# EAGLE schematic post_schematic_v4_charlieplex_v30 (EAGLE 9.7.0)

## Sheet 1 of 2: post_schematic_v4_charlieplex
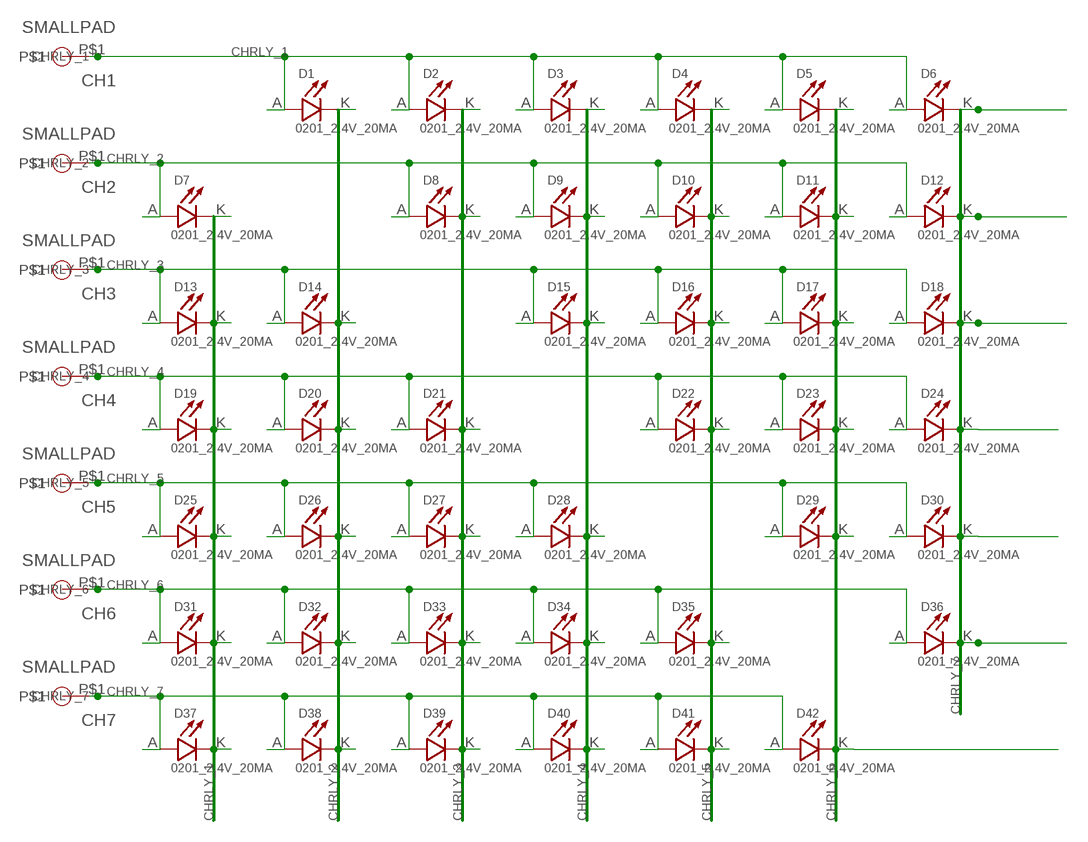
[diagram p0: schematic, sheet 1]

### Parts
CH1  SMALLPAD  [SMALLPAD]
CH2  SMALLPAD  [SMALLPAD]
CH3  SMALLPAD  [SMALLPAD]
CH4  SMALLPAD  [SMALLPAD]
CH5  SMALLPAD  [SMALLPAD]
CH6  SMALLPAD  [SMALLPAD]
CH7  SMALLPAD  [SMALLPAD]
D1  0201_2.4V_20MA  [0201_2.4V_20MA]
D2  0201_2.4V_20MA  [0201_2.4V_20MA]
D3  0201_2.4V_20MA  [0201_2.4V_20MA]
D4  0201_2.4V_20MA  [0201_2.4V_20MA]
D5  0201_2.4V_20MA  [0201_2.4V_20MA]
D6  0201_2.4V_20MA  [0201_2.4V_20MA]
D7  0201_2.4V_20MA  [0201_2.4V_20MA]
D8  0201_2.4V_20MA  [0201_2.4V_20MA]
D9  0201_2.4V_20MA  [0201_2.4V_20MA]
D10  0201_2.4V_20MA  [0201_2.4V_20MA]
D11  0201_2.4V_20MA  [0201_2.4V_20MA]
D12  0201_2.4V_20MA  [0201_2.4V_20MA]
D13  0201_2.4V_20MA  [0201_2.4V_20MA]
D14  0201_2.4V_20MA  [0201_2.4V_20MA]
D15  0201_2.4V_20MA  [0201_2.4V_20MA]
D16  0201_2.4V_20MA  [0201_2.4V_20MA]
D17  0201_2.4V_20MA  [0201_2.4V_20MA]
D18  0201_2.4V_20MA  [0201_2.4V_20MA]
D19  0201_2.4V_20MA  [0201_2.4V_20MA]
D20  0201_2.4V_20MA  [0201_2.4V_20MA]
D21  0201_2.4V_20MA  [0201_2.4V_20MA]
D22  0201_2.4V_20MA  [0201_2.4V_20MA]
D23  0201_2.4V_20MA  [0201_2.4V_20MA]
D24  0201_2.4V_20MA  [0201_2.4V_20MA]
D25  0201_2.4V_20MA  [0201_2.4V_20MA]
D26  0201_2.4V_20MA  [0201_2.4V_20MA]
D27  0201_2.4V_20MA  [0201_2.4V_20MA]
D28  0201_2.4V_20MA  [0201_2.4V_20MA]
D29  0201_2.4V_20MA  [0201_2.4V_20MA]
D30  0201_2.4V_20MA  [0201_2.4V_20MA]
D31  0201_2.4V_20MA  [0201_2.4V_20MA]
D32  0201_2.4V_20MA  [0201_2.4V_20MA]
D33  0201_2.4V_20MA  [0201_2.4V_20MA]
D34  0201_2.4V_20MA  [0201_2.4V_20MA]
D35  0201_2.4V_20MA  [0201_2.4V_20MA]
D36  0201_2.4V_20MA  [0201_2.4V_20MA]
D37  0201_2.4V_20MA  [0201_2.4V_20MA]
D38  0201_2.4V_20MA  [0201_2.4V_20MA]
D39  0201_2.4V_20MA  [0201_2.4V_20MA]
D40  0201_2.4V_20MA  [0201_2.4V_20MA]
D41  0201_2.4V_20MA  [0201_2.4V_20MA]
D42  0201_2.4V_20MA  [0201_2.4V_20MA]

### Nets
CHRLY_1: CH1.P$1 D1.A D2.A D3.A D4.A D5.A D6.A D7.K D13.K D19.K D25.K D31.K D37.K
CHRLY_2: CH2.P$1 D1.K D7.A D8.A D9.A D10.A D11.A D12.A D14.K D20.K D26.K D32.K D38.K
CHRLY_3: CH3.P$1 D2.K D8.K D13.A D14.A D15.A D16.A D17.A D18.A D21.K D27.K D33.K D39.K
CHRLY_4: CH4.P$1 D3.K D9.K D15.K D19.A D20.A D21.A D22.A D23.A D24.A D28.K D34.K D40.K
CHRLY_5: CH5.P$1 D4.K D10.K D16.K D22.K D25.A D26.A D27.A D28.A D29.A D30.A D35.K D41.K
CHRLY_6: CH6.P$1 D5.K D11.K D17.K D23.K D29.K D31.A D32.A D33.A D34.A D35.A D36.A D42.K
CHRLY_7: CH7.P$1 D6.K D12.K D18.K D24.K D30.K D36.K D37.A D38.A D39.A D40.A D41.A D42.A

## Sheet 2 of 2
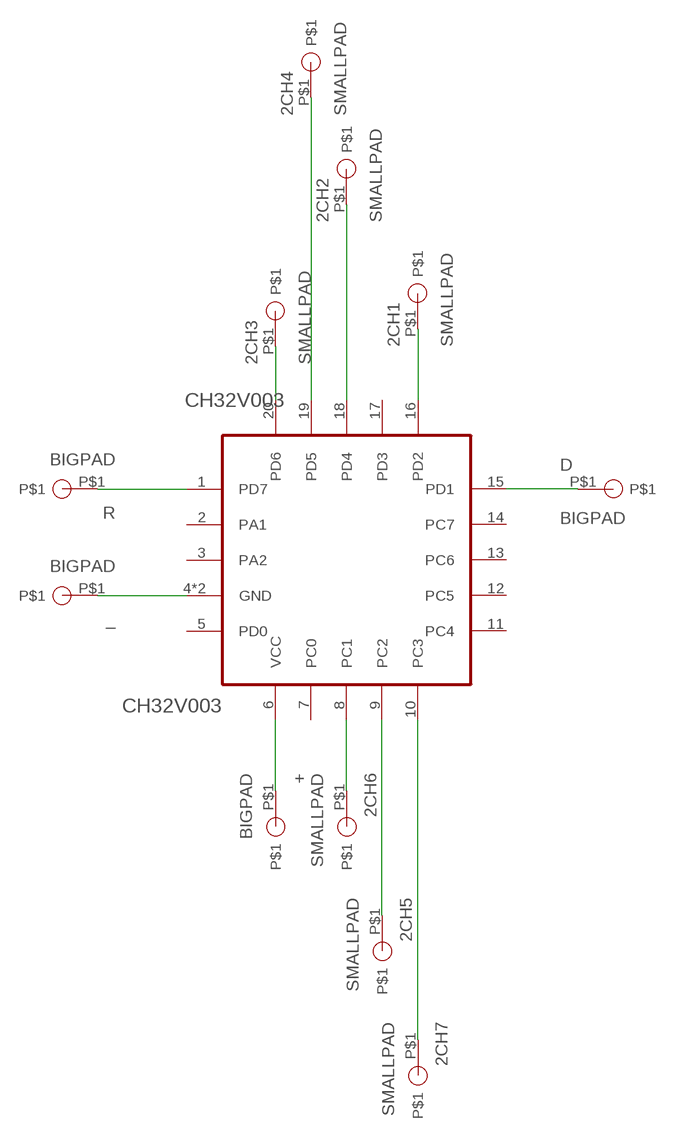
[diagram p1: schematic, sheet 2]

### Parts
2CH1  SMALLPAD  [SMALLPAD]
2CH2  SMALLPAD  [SMALLPAD]
2CH3  SMALLPAD  [SMALLPAD]
2CH4  SMALLPAD  [SMALLPAD]
2CH5  SMALLPAD  [SMALLPAD]
2CH6  SMALLPAD  [SMALLPAD]
2CH7  SMALLPAD  [SMALLPAD]
+  BIGPAD  [BIGPAD]
_  BIGPAD  [BIGPAD]
CH32V003  CH32V003  [QFN40P300X300X90-21N]
D  BIGPAD  [BIGPAD]
R  BIGPAD  [BIGPAD]

### Nets
N$1: +.P$1 CH32V003.6(VCC)
N$2: _.P$1 CH32V003.4(GND) CH32V003.21(GND)
N$3: CH32V003.1(PD7) R.P$1
N$4: CH32V003.15(PD1) D.P$1
N$5: 2CH1.P$1 CH32V003.16(PD2)
N$6: 2CH2.P$1 CH32V003.18(PD4)
N$7: 2CH3.P$1 CH32V003.20(PD6)
N$8: 2CH4.P$1 CH32V003.19(PD5)
N$9: 2CH6.P$1 CH32V003.8(PC1)
N$10: 2CH5.P$1 CH32V003.9(PC2)
N$11: 2CH7.P$1 CH32V003.10(PC3)
Unconnected: CH32V003.2(PA1) CH32V003.3(PA2) CH32V003.5(PD0) CH32V003.7(PC0) CH32V003.11(PC4) CH32V003.12(PC5) CH32V003.13(PC6) CH32V003.14(PC7) CH32V003.17(PD3)

## Library data of the parts
2CH1-2CH7 CH1-CH7 = CH32LEDBoardCommon:SMALLPAD
+ _ D R = CH32LEDBoardCommon:BIGPAD
CH32V003 = CH32LEDBoardCommon:CH32V003: Check availability <https://pricing.snapeda.com/parts/ATTINY816-MF/Microchip%20Technology/view-part?ref=eda>; AVAILABILITY: In Stock; CHECK_PRICES: https://www.snapeda.com/parts/ATTINY816-MF/Microchip/view-part/?ref=eda; DESCRIPTION: AVR tinyAVR™ 1, Functional Safety (FuSa) Microcontroller IC 8-Bit 16MHz 8KB (8K x 8) FLASH 20-VQFN (3x3); MF: Microchip Technology; MP: ATTINY816-MF; PACKAGE: None; PRICE: None; SNAPEDA_LINK: https://www.snapeda.com/parts/ATTINY816-MF/Microchip/view-part/?ref=snap
D1-D42 = CH32LEDBoardCommon:0201_2.4V_20MA: Check availability <https://pricing.snapeda.com/parts/APG0603CGC-TT/Kingbright/view-part?ref=eda>; AVAILABILITY: In Stock; CHECK_PRICES: https://www.snapeda.com/parts/APG0603CGC-TT/Kingbright/view-part/?ref=eda; DESCRIPTION: Green 571nm LED Indication - Discrete 1.97V 2-SMD, 0201; FOOTPRINT: pre_schematic_v4:LED_APG0603CGC-TT; MF: Kingbright; MP: APG0603CGC-TT; PACKAGE: 0201 Kingbright; PRICE: None; SNAPEDA_LINK: https://www.snapeda.com/parts/APG0603CGC-TT/Kingbright/view-part/?ref=snap